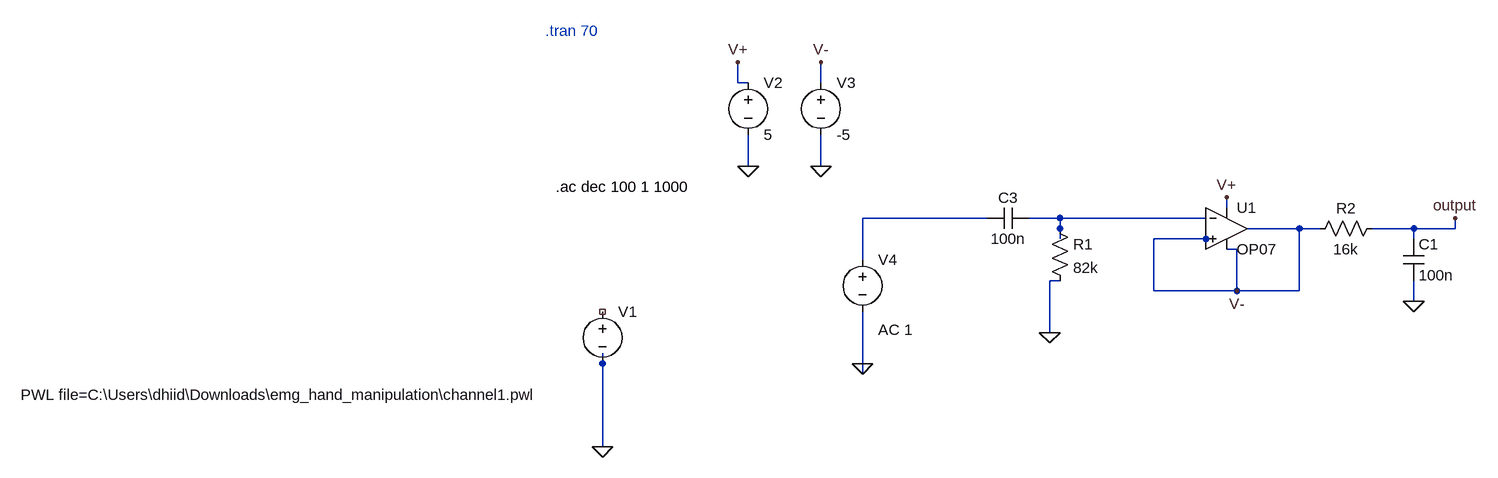
[diagram p0: schematic EMG_Analogue_frontend.asc]
EMG_Analogue_frontend.asc, the LTspice schematic file:
Version 4.1
SHEET 1 1368 680
WIRE 208 -192 208 -224
WIRE 224 -192 208 -192
WIRE 336 -192 336 -224
WIRE 224 -64 224 -112
WIRE 336 -64 336 -112
WIRE 960 0 960 -16
WIRE 592 16 400 16
WIRE 704 16 656 16
WIRE 928 16 704 16
WIRE 704 32 704 16
WIRE 1072 32 992 32
WIRE 1104 32 1072 32
WIRE 1248 32 1184 32
WIRE 1312 32 1312 16
WIRE 1312 32 1248 32
WIRE 704 48 704 32
WIRE 928 48 848 48
WIRE 944 48 928 48
WIRE 1248 48 1248 32
WIRE 976 64 960 64
WIRE 400 80 400 16
WIRE 704 112 688 112
WIRE 848 128 848 48
WIRE 976 128 976 64
WIRE 976 128 848 128
WIRE 1072 128 1072 32
WIRE 1072 128 976 128
WIRE 1248 144 1248 112
WIRE 688 192 688 112
WIRE 0 240 0 224
WIRE 400 240 400 160
WIRE 400 256 400 240
WIRE 0 368 0 240
FLAG 0 368 0
FLAG 224 -64 0
FLAG 336 -64 0
FLAG 208 -224 V+
FLAG 336 -224 V-
FLAG 960 -16 V+
FLAG 976 128 V-
FLAG 1312 16 output
FLAG 400 240 0
FLAG 688 192 0
FLAG 1248 144 0
SYMBOL voltage 0 144 R0
WINDOW 3 -895 144 Left 2
WINDOW 123 -740 419 Left 2
WINDOW 39 0 0 Left 0
SYMATTR InstName V1
SYMATTR Value PWL file=C:\Users\dhiid\Downloads\emg_hand_manipulation\channel1.pwl
SYMBOL OpAmps\\OP07 960 -32 R0
SYMATTR InstName U1
SYMBOL voltage 224 -208 R0
WINDOW 123 0 0 Left 0
WINDOW 39 0 0 Left 0
SYMATTR InstName V2
SYMATTR Value 5
SYMBOL voltage 336 -208 R0
WINDOW 123 0 0 Left 0
WINDOW 39 0 0 Left 0
SYMATTR InstName V3
SYMATTR Value -5
SYMBOL voltage 400 64 R0
WINDOW 123 24 124 Left 2
WINDOW 39 0 0 Left 0
SYMATTR InstName V4
SYMATTR Value ""
SYMATTR Value2 AC 1
SYMBOL cap 656 0 R90
WINDOW 0 0 32 VBottom 2
WINDOW 3 32 32 VTop 2
SYMATTR InstName C3
SYMATTR Value 100n
SYMBOL res 688 16 R0
SYMATTR InstName R1
SYMATTR Value 82k
SYMBOL res 1200 16 R90
WINDOW 0 0 56 VBottom 2
WINDOW 3 32 56 VTop 2
SYMATTR InstName R2
SYMATTR Value 16k
SYMBOL cap 1232 48 R0
SYMATTR InstName C1
SYMATTR Value 100n
TEXT -88 -272 Left 2 ;.tran 70
TEXT -72 -32 Left 2 !.ac dec 100 1 1000

The netlist it stands for:
* EMG_Analogue_frontend.asc
V1 NC_01 0 PWL file=C:\Users\dhiid\Downloads\emg_hand_manipulation\channel1.pwl
X§U1 V- N002 V+ V- V- LT1001  ; OP07, pins In+ In- V+ V- OUT
V2 V+ 0 5
V3 V- 0 -5
V4 N001 0 AC 1
C3 N002 N001 100n
R1 N002 0 82k
R2 output V- 16k
C1 output 0 100n
* .tran 70
.ac dec 100 1 1000
.lib LTC.lib
.backanno
.end